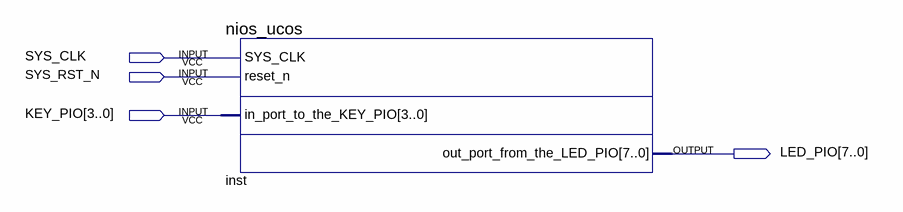
[diagram p0: schematic sheet]
// Quartus schematic ucos.bdf as structural Verilog: 1 symbols, 4 pins
module ucos (
  input  SYS_CLK,
  input  SYS_RST_N,
  input  [3:0] KEY_PIO,
  output [7:0] LED_PIO
);

  nios_ucos inst (
    .SYS_CLK(SYS_CLK), .reset_n(SYS_RST_N), .in_port_to_the_KEY_PIO(KEY_PIO),
    .out_port_from_the_LED_PIO(LED_PIO));
endmodule
